# Altium schematic sheet Kasli-SOC_bank500-501.SchDoc: SOC
size 420 x 297 mm; CheckedBy: G.Kasprowicz; Author: F.Switakowski; CompanyName: WUT ISE; DrawnBy: F.Switakowski; Organization: WUT ISE; Address1: PW ISE; Address2: Nowowiejska 15/19 00-665 Warsaw; Address3: gkasprow@gmail.com; DocumentNumber: 3; Revision: 1; SheetNumber: 3; SheetTotal: 18; ModifiedBy: -; CheckedDate: -; Title2: Bank 500-501; DivGrp: WUT ISE; Designer: G.Kasprowicz; ModifiedDate: -; ProjectName: Sensor Box
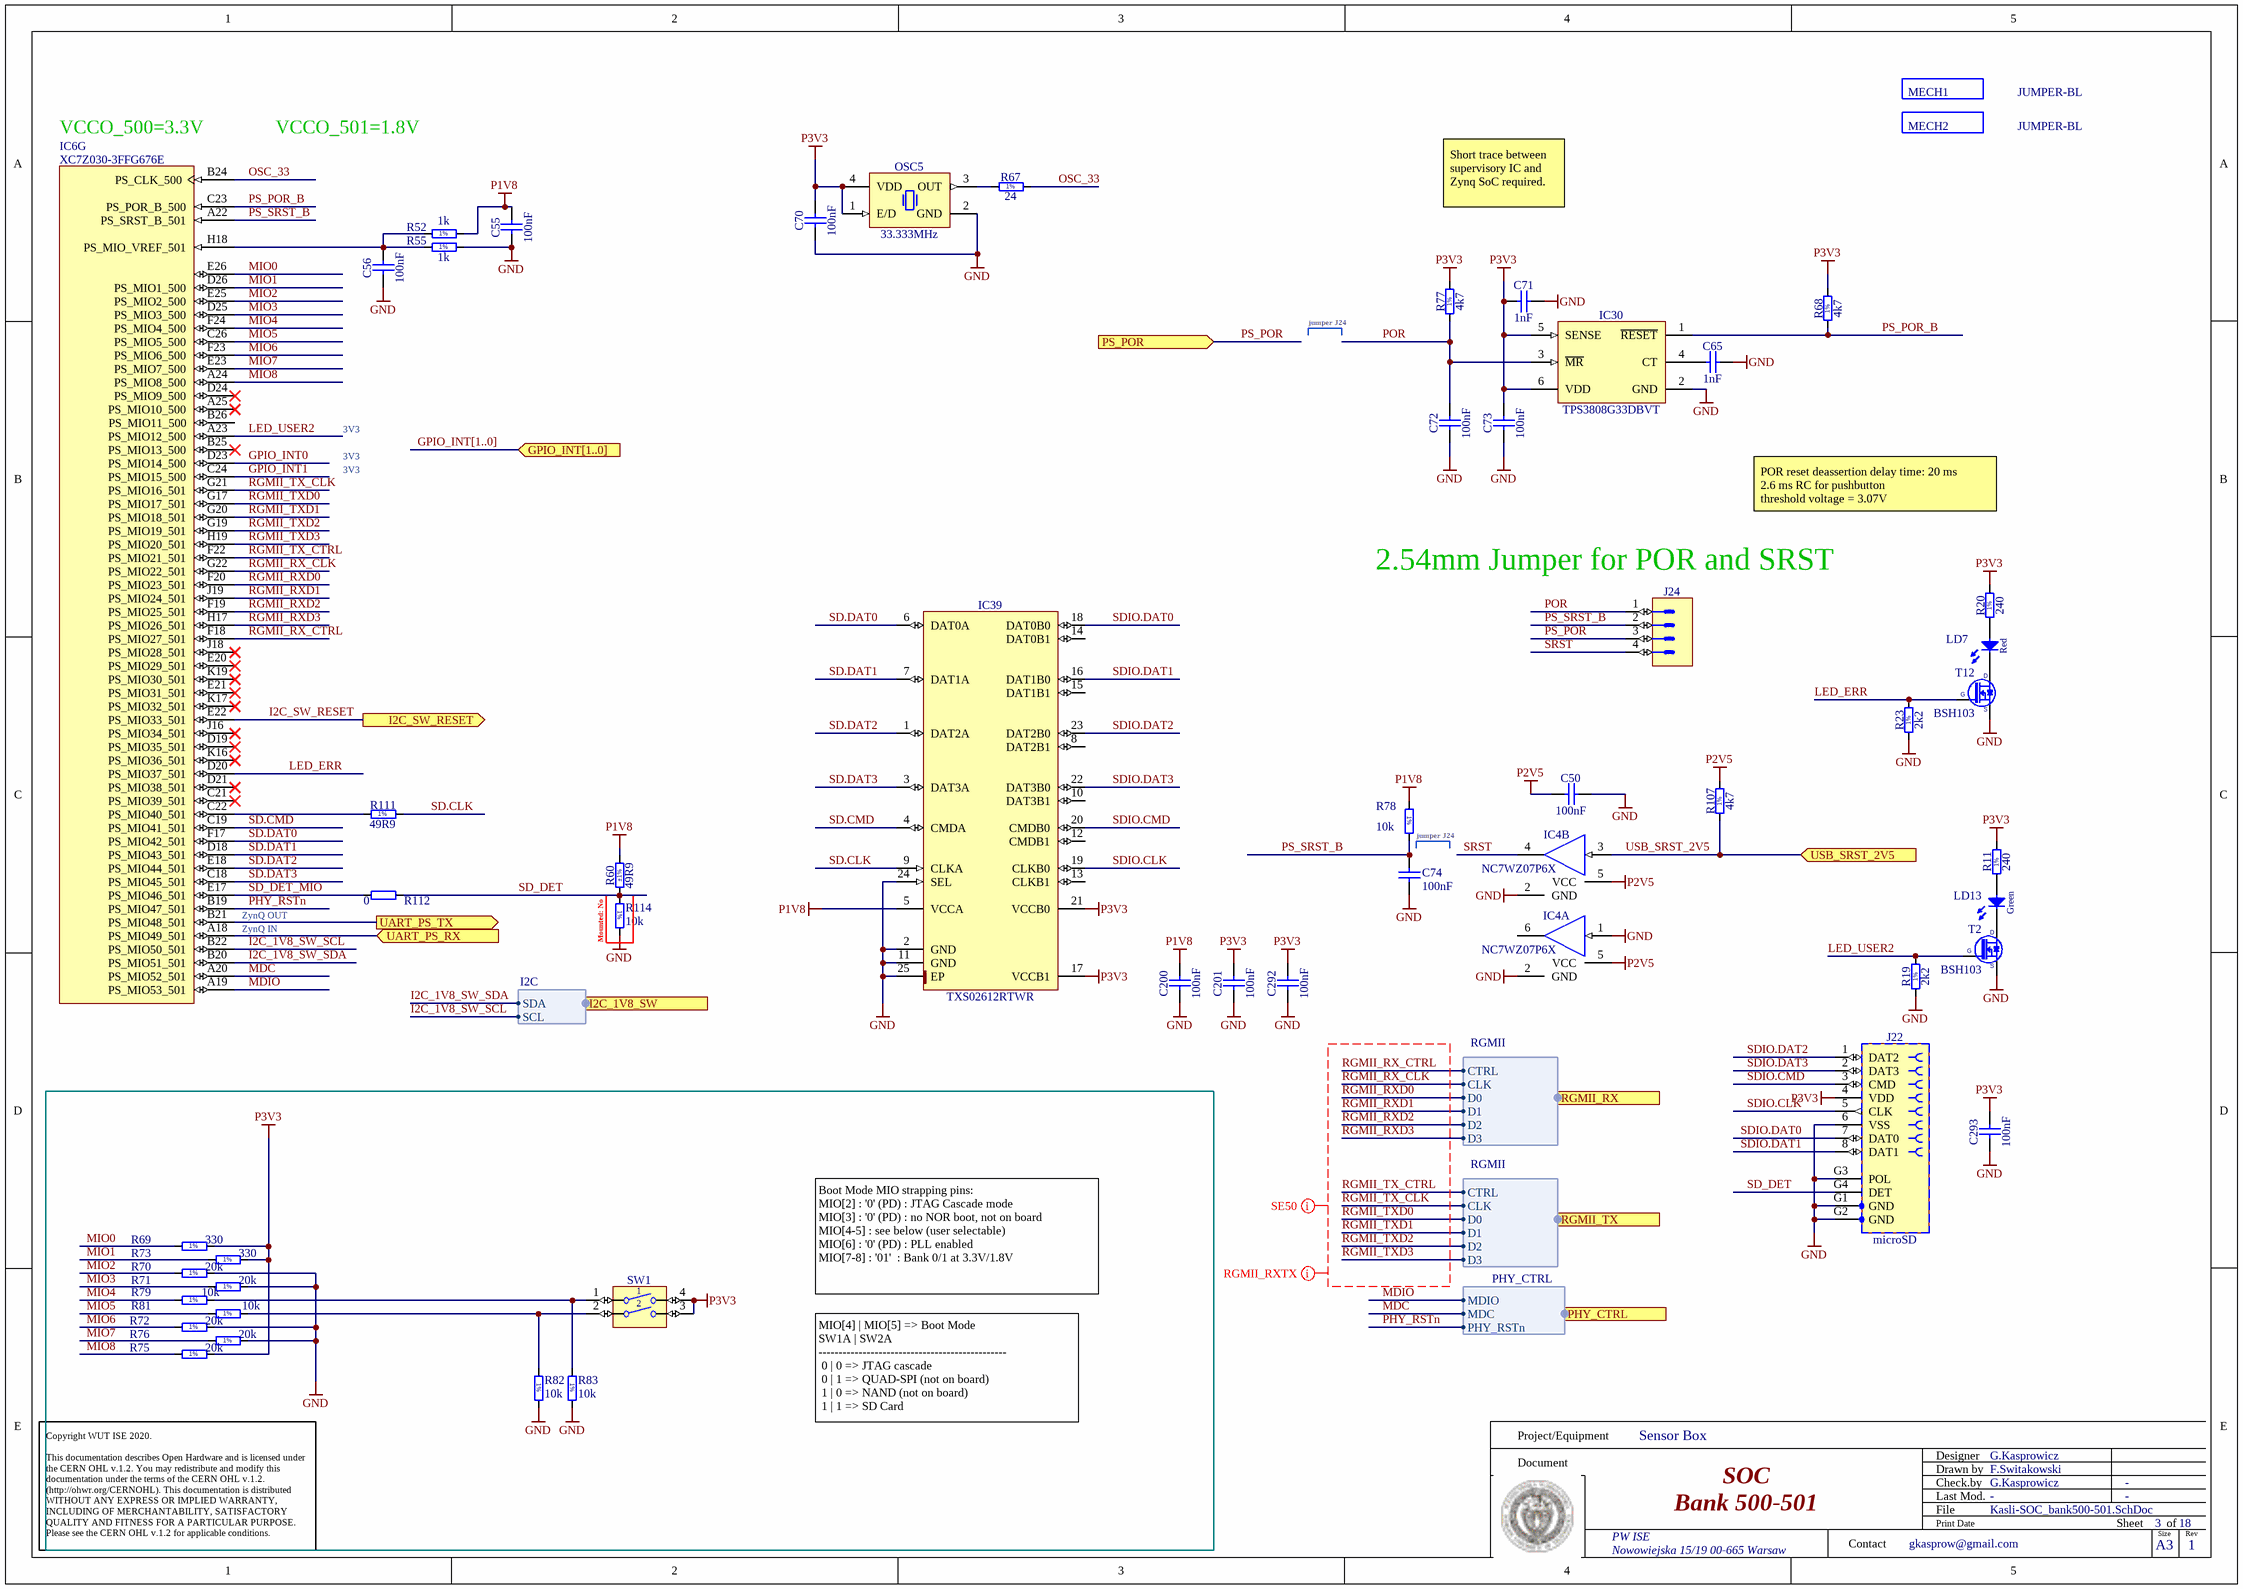
[diagram p0: Kasli-SOC_bank500-501.SchDoc]

## Parts
C50  100nF  [CAPC0603X33N]
C55  100nF  [CAPC1005X55N]
C56  100nF  [CAPC1005X55N]
C65  1nF  [CAPC1005X55N]
C70  100nF  [CAPC1005X55N]
C71  1nF  [CAPC1005X55N]
C72  100nF  [CAPC1005X55N]
C73  100nF  [CAPC1005X55N]
C74  100nF  [CAPC1005X55N]
C200  100nF  [CAPC1005X55N]
C201  100nF  [CAPC1005X55N]
C292  100nF  [CAPC1005X55N]
C293  100nF  [CAPC1005X55N]
IC4  NC7WZ07P6X  [SOT65P210X110-6N]  (parts A,B of 2)
IC6  XC7Z030-3FFG676E  [BGA676C100P26X26_2700X2700X324]  (part G of 14)
IC30  TPS3808G33DBVT  [SOT95P280X145-6N]
IC39  TXS02612RTWR  [QFN50P400X400X80-25N-S255]
J22  microSD  [MOLEX_47309-2651]
J24  Header 2  [SAMTEC_TSM-102-01-L-DV]  (value not drawn)
LD7  Red  [LED_AVAGO_HSMC-C120]
LD13  Green  [LED_AVAGO_HSME-C120]
MECH1  JUMPER-BL  (mechanical)
MECH2  JUMPER-BL  (mechanical)
OSC5  33.333MHz  [OSC_IDT_XLH7]
R11  240  [RESC1005X40N]
R19  2k2  [RESC1005X40N]
R20  240  [RESC1005X40N]
R23  2k2  [RESC1005X40N]
R52  1k  [RESC1005X40N]
R55  1k  [RESC1005X40N]
R60  49R9  Tolerance: ±1%  [RESC1608X55N]
R67  24  [RESC1005X40N]
R68  4k7  [RESC1005X40N]
R69  330  [RESC1005X40N]
R70  20k  [RESC1005X40N]
R71  20k  [RESC1005X40N]
R72  20k  [RESC1005X40N]
R73  330  [RESC1005X40N]
R75  20k  [RESC1005X40N]
R76  20k  [RESC1005X40N]
R77  4k7  [RESC1005X40N]
R78  10k  [RESC1005X40N]
R79  10k  [RESC1005X40N]
R81  10k  [RESC1005X40N]
R82  10k  [RESC1005X40N]
R83  10k  [RESC1005X40N]
R107  4k7  [RESC1005X40N]
R111  49R9  [RESC1005X40N]
R112  0  [RESC1005X40N]
R114  10k  [RESC1005X40N]
SW1  Switch  [SW_TYCO_1571983-1]  (value not drawn)
T2  BSH103  [SOT95P230X110-3N]
T12  BSH103  [SOT95P230X110-3N]

## Ports
GPIO_INT[1..0] (in), I2C_1V8_SW (harness I2C), I2C_SW_RESET (out), PHY_CTRL (harness PHY_CTRL), PS_POR (in), RGMII_RX (harness RGMII), RGMII_TX (harness RGMII), UART_PS_RX (in), UART_PS_TX (out), USB_SRST_2V5 (in)

## Harnesses
I2C: SDA, SCL
RGMII: CTRL, CLK, D0, D1, D2, D3
PHY_CTRL: MDIO, MDC, PHY_RSTn

## Nets
GND: C50.2 C55.1 C56.1 C65.2 C70.1 C71.2 C72.1 C73.1 C74.2 C200.1 C201.1 C292.1 C293.1 IC4.1(IN) IC4.2(GND) IC30.2(GND) IC39.2(GND) IC39.11(GND) IC39.24(SEL) IC39.25(EP) J22.6(VSS) J22.G1(GND) J22.G2(GND) J22.G3(POL) OSC5.2(GND) R19.1 R23.1 R55.2 R70.2 R71.2 R72.2 R76.2 R82.2 R83.2 R114.2 T2.2(S) T12.2(S)
P1V8: C55.2 C200.2 IC39.5(VCCA) R52.2 R60.2 R78.1
P2V5: C50.1 IC4.5(VCC) R107.2
P3V3: C70.2 C71.1 C73.2 C201.2 C292.2 C293.2 IC30.5(SENSE) IC30.6(VDD) IC39.17(VCCB1) IC39.21(VCCB0) J22.4(VDD) OSC5.1(E/D) OSC5.4(VDD) R11.2 R20.2 R68.2 R69.2 R73.2 R75.2 R77.2 SW1.3 SW1.4
GPIO_INT0: IC6.D23(PS_MIO14_500)
GPIO_INT1: IC6.C24(PS_MIO15_500)
I2C_1V8_SW_SCL: IC6.B22(PS_MIO50_501) ; port I2C_1V8_SW.SCL
I2C_1V8_SW_SDA: IC6.B20(PS_MIO51_501) ; port I2C_1V8_SW.SDA
I2C_SW_RESET: IC6.E22(PS_MIO33_501) ; port I2C_SW_RESET
LED_ERR: IC6.D20(PS_MIO37_501) R23.2 T12.1(G)
LED_USER2: IC6.A23(PS_MIO12_500) R19.2 T2.1(G)
MDC: IC6.A20(PS_MIO52_501) ; port PHY_CTRL.MDC
MDIO: IC6.A19(PS_MIO53_501) ; port PHY_CTRL.MDIO
MIO0: IC6.E26(PS_MIO0_500) R69.1
MIO1: IC6.D26(PS_MIO1_500) R73.1
MIO2: IC6.E25(PS_MIO2_500) R70.1
MIO3: IC6.D25(PS_MIO3_500) R71.1
MIO4: IC6.F24(PS_MIO4_500) R79.1
MIO5: IC6.C26(PS_MIO5_500) R81.1
MIO6: IC6.F23(PS_MIO6_500) R72.1
MIO7: IC6.E23(PS_MIO7_500) R76.1
MIO8: IC6.A24(PS_MIO8_500) R75.1
OSC_33: IC6.B24(PS_CLK_500) R67.2
PHY_RSTn: IC6.B19(PS_MIO47_501) ; port PHY_CTRL.PHY_RSTn
POR: C72.2 IC30.3(~{MR}) J24.1 R77.1
PS_POR: J24.3 ; port PS_POR
PS_POR_B: IC6.C23(PS_POR_B_500) IC30.1(~{RESET}) R68.1
PS_SRST_B: C74.1 IC6.A22(PS_SRST_B_501) J24.2 R78.2
RGMII_RX_CLK: IC6.G22(PS_MIO22_501) ; port RGMII_RX.CLK
RGMII_RX_CTRL: IC6.F18(PS_MIO27_501) ; port RGMII_RX.CTRL
RGMII_RXD0: IC6.F20(PS_MIO23_501) ; port RGMII_RX.D0
RGMII_RXD1: IC6.J19(PS_MIO24_501) ; port RGMII_RX.D1
RGMII_RXD2: IC6.F19(PS_MIO25_501) ; port RGMII_RX.D2
RGMII_RXD3: IC6.H17(PS_MIO26_501) ; port RGMII_RX.D3
RGMII_TX_CLK: IC6.G21(PS_MIO16_501) ; port RGMII_TX.CLK
RGMII_TX_CTRL: IC6.F22(PS_MIO21_501) ; port RGMII_TX.CTRL
RGMII_TXD0: IC6.G17(PS_MIO17_501) ; port RGMII_TX.D0
RGMII_TXD1: IC6.G20(PS_MIO18_501) ; port RGMII_TX.D1
RGMII_TXD2: IC6.G19(PS_MIO19_501) ; port RGMII_TX.D2
RGMII_TXD3: IC6.H19(PS_MIO20_501) ; port RGMII_TX.D3
SD.CLK: IC39.9(CLKA) R111.2
SD.CMD: IC6.C19(PS_MIO41_501) IC39.4(CMDA)
SD.DAT0: IC6.F17(PS_MIO42_501) IC39.6(DAT0A)
SD.DAT1: IC6.D18(PS_MIO43_501) IC39.7(DAT1A)
SD.DAT2: IC6.E18(PS_MIO44_501) IC39.1(DAT2A)
SD.DAT3: IC6.C18(PS_MIO45_501) IC39.3(DAT3A)
SD_DET: J22.G4(DET) R60.1 R112.1 R114.1
SD_DET_MIO: IC6.E17(PS_MIO46_501) R112.2
SDIO.CLK: IC39.19(CLKB0) J22.5(CLK)
SDIO.CMD: IC39.20(CMDB0) J22.3(CMD)
SDIO.DAT0: IC39.18(DAT0B0) J22.7(DAT0)
SDIO.DAT1: IC39.16(DAT1B0) J22.8(DAT1)
SDIO.DAT2: IC39.23(DAT2B0) J22.1(DAT2)
SDIO.DAT3: IC39.22(DAT3B0) J22.2(DAT3)
SRST: IC4.4(OUT) J24.4
UART_PS_RX: IC6.A18(PS_MIO49_501) ; port UART_PS_RX
UART_PS_TX: IC6.B21(PS_MIO48_501) ; port UART_PS_TX
USB_SRST_2V5: IC4.3(IN) R107.1 ; port USB_SRST_2V5
NetC56_2: C56.2 IC6.H18(PS_MIO_VREF_501) R52.1 R55.1
NetC65_1: C65.1 IC30.4(CT)
NetIC6_C22: IC6.C22(PS_MIO40_501) R111.1
NetLD7_1: LD7.1(C) T12.3(D)
NetLD7_2: LD7.2(A) R20.1
NetLD13_1: LD13.1(C) T2.3(D)
NetLD13_2: LD13.2(A) R11.1
NetOSC5_3: OSC5.3(OUT) R67.1
NetR79_2: R79.2 R83.1 SW1.1
NetR81_2: R81.2 R82.1 SW1.2

Not connected (* = marked no-connect by the designer): IC4 6(OUT); IC6 A25(PS_MIO10_500)* B25(PS_MIO13_500)* B26(PS_MIO11_500) C21(PS_MIO39_501)* D19(PS_MIO35_501)* D21(PS_MIO38_501)* D24(PS_MIO9_500)* E20(PS_MIO29_501)* E21(PS_MIO31_501)* J16(PS_MIO34_501)* J18(PS_MIO28_501)* K16(PS_MIO36_501)* K17(PS_MIO32_501)* K19(PS_MIO30_501)*; IC39 8(DAT2B1) 10(DAT3B1) 12(CMDB1) 13(CLKB1) 14(DAT0B1) 15(DAT1B1)

## Buses and harness runs
bus GPIO_INT[1..0] = port GPIO_INT[1..0]

## Layout directives
net class RGMII_RXTX: RGMII_RX_CLK, RGMII_RX_CTRL, RGMII_RXD0, RGMII_RXD1, RGMII_RXD2, RGMII_RXD3, RGMII_TX_CLK, RGMII_TX_CTRL, RGMII_TXD0, RGMII_TXD1, RGMII_TXD2, RGMII_TXD3
net class SE50: RGMII_RX_CLK, RGMII_RX_CTRL, RGMII_RXD0, RGMII_RXD1, RGMII_RXD2, RGMII_RXD3, RGMII_TX_CLK, RGMII_TX_CTRL, RGMII_TXD0, RGMII_TXD1, RGMII_TXD2, RGMII_TXD3

## Notes on the sheet
- (near IC6) VCCO_500=3.3V
- VCCO_501=1.8V
- Short trace between supervisory IC and Zynq SoC required.
- jumper J24
- 3V3
- POR reset deassertion delay time: 20 ms
  2.6 ms RC for pushbutton
  threshold voltage = 3.07V
- (near J24) 2.54mm Jumper for POR and SRST
- (near R78) jumper J24
- (near IC6) ZynQ OUT
- (near IC6) ZynQ IN
- Mounted: No
- Boot Mode MIO strapping pins:
  MIO[2]	: '0' (PD)	: JTAG Cascade mode
  MIO[3]	: '0' (PD)	: no NOR boot, not on board
  MIO[4-5]	: see below (user selectable)
  MIO[6]	: '0' (PD)	: PLL enabled
  MIO[7-8]	: '01' 	: Bank 0/1 at 3.3V/1.8V
- MIO[4]	| MIO[5]	=> Boot Mode
  SW1A	| SW2A
  -----------------------------------------------
  0	| 0	=> JTAG cascade
  0	| 1	=> QUAD-SPI (not on board)
  1	| 0	=> NAND (not on board)
  1	| 1	=> SD Card
- Project/Equipment
- Document
- Designer
- Drawn by
- Check.by
- Copyright WUT ISE 2020.
  This documentation describes Open Hardware and is licensed under the CERN OHL v.1.2. You may redistribute and modify this documentation under the terms of the CERN OHL v.1.2. (http://ohwr.org/CERNOHL). This documentation is distributed WITHOUT ANY EXPRESS OR IMPLIED WARRANTY, INCLUDING OF MERCHANTABILITY, SATISFACTORY QUALITY AND FITNESS FOR A PARTICULAR PURPOSE. Please see the CERN OHL v.1.2 for applicable conditions.
- Contact
- File
- Last Mod.
- Print Date
- Sheet
- Size
- A3
- of
- Rev
- (in symbol R0402_1K_1%_0.0625W_100PPM) 1%
- (in symbol R0402_2K2_1%_0.0625W_100PPM) 1%
- (in symbol R0402_4K7_1%_0.0625W_100PPM) 1%
- (in symbol R0402_10K_1%_0.0625W_100PPM) 1%
- (in symbol R0402_20K_1%_0.0625W_100PPM) 1%
- (in symbol R0402_24R_1%_0.0625W_100PPM) 1%
- (in symbol R0402_49R9_1%_0.0625W_100PPM) 1%
- (in symbol R0402_240R_1%_0.0625W_100PPM) 1%
- (in symbol R0402_330R_1%_0.0625W_100PPM) 1%

## Library data of the parts
C50 = CC0201_100NF_6.3V_10%_X5R: Non-polarised capacitor; Part Description: SMD Multilayer Chip Ceramic Capacitor; Manufacturer: GENERIC; Manufacturer1 Part Number: 02016D104KAT2A; Voltage: 6.3V; TC: X5R; Tolerance: ±10%; Part Number: CC0201_100NF_6.3V_10%_X5R; Component Kind: Standard; Component Type: Standard; Pin Count: 2; Value: 100nF; Status: Not Recommended; Manufacturer Part Number: CC0201_100NF_6.3V_10%_X5R; Case: 0201; Mounted: Yes; Socket: No; SMD: Yes; Sense: No; Manufacturer1 Example: AVX; Manufacturer1 ComponentHeight: 0.33mm; HelpURL: \\cern.ch\dfs\Applications\Altium\Datasheets\CC0201_X5R_AVX.pdf; Author: CERN DEM JLC; CreateDate: 03.12.2007; LatestRevisionDate: 03.12.2007
C55 C56 C70 C72 C73 C200 C201 C292 C293 = CC0402_100NF_16V_10%_X7R: Non-polarised capacitor; Part Description: SMD Multilayer Chip Ceramic Capacitor; Manufacturer: GENERIC; Manufacturer1 Part Number: GRM155R71C104KA88D; Voltage: 16V; TC: X7R; Tolerance: ±10%; Part Number: CC0402_100NF_16V_10%_X7R; Component Kind: Standard; Component Type: Standard; Pin Count: 2; Value: 100nF; Status: Not Recommended; Manufacturer Part Number: CC0402_100NF_16V_10%_X7R; Case: 0402; Mounted: Yes; Socket: No; SMD: Yes; Sense: No; Manufacturer1 Example: MURATA; Manufacturer1 ComponentHeight: 0.55mm; HelpURL: \\cern.ch\dfs\Applications\Altium\Datasheets\CC0402_X7R_MURATA_GRM.pdf; Author: CERN DEM JLC; CreateDate: 05/12/2013; LatestRevisionDate: 03/12/2007
C65 C71 = CC0402_1NF_50V_10%_X7R: Non-polarised capacitor; Part Description: SMD Multilayer Chip Ceramic Capacitor; Manufacturer: GENERIC; Manufacturer1 Part Number: 223858715623; Voltage: 50V; TC: X7R; Tolerance: ±10%; Part Number: CC0402_1NF_50V_10%_X7R; Component Kind: Standard; Component Type: Standard; Pin Count: 2; Value: 1nF; Status: Not Recommended; Manufacturer Part Number: CC0402_1NF_50V_10%_X7R; Case: 0402; Mounted: Yes; Socket: No; SMD: Yes; Sense: No; Manufacturer1 Example: PHYCOMP; Manufacturer1 ComponentHeight: 0.55mm; HelpURL: \\cern.ch\dfs\Applications\Altium\Datasheets\CC0402_X7R_PHYCOMP.pdf; Author: CERN DEM JLC
  C65: CreateDate: 03.12.2007; LatestRevisionDate: 03.12.2007
  C71: CreateDate: 03/12/2007; LatestRevisionDate: 03/12/2007
C74 = CC0402_100NF_16V_10%_X7R: Non-polarised capacitor; Part Description: SMD Multilayer Chip Ceramic Capacitor; Manufacturer: GENERIC; Manufacturer1 Part Number: GRM155R71C104KA88D; Voltage: 16V; TC: X7R; Tolerance: ±10%; Table: Capacitors SMD; Part Number: CC0402_100NF_16V_10%_X7R; Component Kind: Standard; Component Type: Standard; Pin Count: 2; Value: 100nF; Status: Not Recommended; Manufacturer Part Number: CC0402_100NF_16V_10%_X7R; Case: 0402; Mounted: Yes; Socket: No; SMD: Yes; Manufacturer1 Example: MURATA; Manufacturer1 ComponentHeight: 0.55mm; HelpURL: \\cern.ch\dfs\Applications\Altium\Datasheets\CC0402_X7R_MURATA_GRM.pdf; Author: CERN DEM JLC; CreateDate: 2013-12-05; LatestRevisionDate: 2007-12-03
IC4 = NC7WZ07P6X: TinyLogic® UHS Dual Buffer (Open Drain Outputs); Manufacturer: FAIRCHILD SEMICONDUCTOR; PressFit: No; Bonding: No; Part Number: NC7WZ07P6X; Component Kind: Standard; Component Type: Standard; Device: NC7WZ07P6X; PackageDescription: SOT363, 0.65mm pitch; 6 pin, 1.40mm W X 2.15mm L, IPC Medium Density; Part Description: TinyLogic® UHS Dual Buffer (Open Drain Outputs); Manufacturer Part Number: NC7WZ07P6X; Pin Count: 6; Case: SOT363; Mounted: Yes; Socket: No; SMD: Yes; Sense: No; ComponentHeight: 1.1mm; Author: CERN DEM JLC; HelpURL: \\cern.ch\dfs\Applications\Altium\Datasheets\NC7WZ07P6X.pdf; CreateDate: 22/10/2008; LatestRevisionDate: 22/03/2012
IC6 = XC7Z030-2FFG676I: 733 MHz Zynq™-7000 AP SoC, 130 PS I/O, 254 FPGA I/O, 676-Ball BGA, Speed Grade 2, Industrial Grade, Pb-Free; Part Description: Zynq™-7000 All Programmable SoC, Dual-core ARM® Cortex™-A9 CPU, 676-Ball BGA, Speed Grade 2, Industrial Grade, Pb-Free; Manufacturer: XILINX; PressFit: No; Bonding: No; Part Number: XC7Z030-3FFG676E; Component Kind: Standard; Component Type: Standard; Device: XC7Z030-2FFG676I; PackageDescription: BGA, 1.00mm Pitch, Square; 676 Pin, 26 Columns X 26 Rows, 27.00mm X 27.00mm X 2.60mm H; Manufacturer Part Number: XC7Z030-3FFG676E; Pin Count: 676; Case: BGA676; Mounted: Yes; Socket: No; SMD: Yes; Sense: No; ComponentHeight: 3.24mm; HelpURL: \\cern.ch\dfs\Applications\Altium\Datasheets\XC7Z030-2FFG676I.pdf; ComponentLink1URL: \\cern.ch\dfs\Applications\Altium\Datasheets\XC7Z030-2FFG676I_Package.pdf; ComponentLink1Description: Package; ComponentLink2URL: \\cern.ch\dfs\Applications\Altium\Datasheets\XC7Z030-2FFG676I_Pinout.txt; ComponentLink2Description: Pinout; Author: CERN DEM JLC; CreateDate: 29/04/2014; LatestRevisionDate: 29/04/2014
IC30 = TPS3808G33DBVT: Low Quiescent Current, Programmable-Delay Supervisory Circuit; Part Description: 3.3V, Low Quiescent Current, Programmable-Delay Supervisory Circuit; Manufacturer: TEXAS INSTRUMENTS; PressFit: No; Bonding: No; Part Number: TPS3808G33DBVT; Component Kind: Standard; Component Type: Standard; Device: TPS3808G33DBVT; PackageDescription: SOT23, 6-Leads, Body 1.6x3.0mm, Pitch 0.95mm, IPC Medium Density; Manufacturer Part Number: TPS3808G33DBVT; Pin Count: 6; Case: SOT23-6; Mounted: Yes; Socket: No; SMD: Yes; Sense: No; ComponentHeight: 1.45mm; Author: CERN DEM JLC; HelpURL: \\cern.ch\dfs\Applications\Altium\Datasheets\TPS3808G33DBVT.pdf; CreateDate: 05/11/2013; LatestRevisionDate: 05/11/2013
IC39 = TXS02612RTWR: SDIO Port Expander With Voltage-Level Translation; Manufacturer: TEXAS INSTRUMENTS; PressFit: No; Bonding: No; Part Number: TXS02612RTWR; Component Kind: Standard; Component Type: Standard; Device: TXS02612RTWR; PackageDescription: QFN, 0.50mm Pitch, Square; 24 Pin, 4.00mm L X 4.00mm W X 0.80mm H body (w/Thermal Tab 2.55 X 2.55mm), IPC Medium Density; Part Description: SDIO Port Expander With Voltage-Level Translation; Manufacturer Part Number: TXS02612RTWR; Pin Count: 25; Case: QFN24; Mounted: Yes; Socket: No; SMD: Yes; Sense: No; ComponentHeight: 0.8mm; Author: CERN DEM JLC; HelpURL: \\cern.ch\dfs\Applications\Altium\Datasheets\TXS02612RTWR.pdf; CreateDate: 19.11.2014; LatestRevisionDate: 19.11.2014
J22 = MOLEX_47309-2651: MicroSD Card Header with Detect Switch; Part Description: 1.10mm Pitch microSD Card Header with Detect Switch; Manufacturer: MOLEX; PressFit: No; Part Number: MOLEX_47309-2651; Component Kind: Standard; Component Type: Standard; Pin Count: 12; Family: microSD; Mounted: Yes; Socket: No; SMD: Yes; Sense: No; Status: None; Manufacturer Part Number: 47309-2651; ComponentHeight: 2.65mm; HelpURL: \\cern.ch\dfs\Applications\Altium\Datasheets\MOLEX_47309-2651.pdf; Author: CERN DEM JMW; CreateDate: 29.06.2017; LatestRevisionDate: 29.06.2017
J24 = SAMTEC_TSM-102-01-L-DV: Connector 4 Male; Part Description: 2 Contacts, Pitch 2.54mm, Dual Row Surface Mount Straight Header (Post Lead 5.84mm); Manufacturer: SAMTEC; PressFit: No; Part Number: SAMTEC_TSM-102-01-L-DV; Component Kind: Standard; Component Type: Standard; Pin Count: 4; Family: Header 2; Mounted: Yes; Socket: No; SMD: Yes; Sense: No; Status: None; Manufacturer Part Number: TSM-102-01-L-DV; ComponentHeight: 9.65mm; HelpURL: \\cern.ch\dfs\Applications\Altium\Datasheets\SAMTEC_TSM-102-01-L-DV.pdf; Author: CERN DEM MR; CreateDate: 28.11.2017; LatestRevisionDate: 28.11.2017
LD7 = LED_AVAGO_HSMC-C120: LED Red 1C 2A; Part Description: High Performance Right Angle Chip Red LED; Manufacturer: AVAGO TECHNOLOGIES; PressFit: No; Bonding: No; Manufacturer Part Number: HSMC-C120; ComponentHeight: 0.7mm; HelpURL: \\cern.ch\dfs\Applications\Altium\Datasheets\LED_AVAGO_HSMC-C120.pdf; Part Number: LED_AVAGO_HSMC-C120; Component Kind: Standard; Component Type: Standard; Color: Red; PackageDescription: Red Chip LED, 2-Leads, Body 1.7x1.1mm, Side Emitting Package; Pin Count: 2; Mounted: Yes; Socket: No; SMD: Yes; Sense: No; Author: CERN DEM JMW; CreateDate: 2009-07-22; LatestRevisionDate: 2012-06-20; ComponentLink1URL: \\cern.ch\dfs\Applications\Altium\Datasheets\LED_AVAGO_HSMC-C120_DESIGN-GUIDE.pdf; ComponentLink1Description: Design Guide
LD13 = LED_AVAGO_HSME-C120: LED Green 1C 2A; Part Description: High Performance Right Angle Chip Green LED; Manufacturer: AVAGO TECHNOLOGIES; PressFit: No; Bonding: No; Manufacturer Part Number: HSME-C120; ComponentHeight: 0.7mm; HelpURL: \\cern.ch\dfs\Applications\Altium\Datasheets\LED_AVAGO_HSME-C120.pdf; Part Number: LED_AVAGO_HSME-C120; Component Kind: Standard; Component Type: Standard; Color: Green; PackageDescription: Green Chip LED, 2-Leads, Body 1.7x1.1mm, Side Emitting Package; Pin Count: 2; Mounted: Yes; Socket: No; SMD: Yes; Sense: No; Author: CERN DEM JMW; CreateDate: 22.07.2009; LatestRevisionDate: 20.06.2012; ComponentLink1URL: \\cern.ch\dfs\Applications\Altium\Datasheets\LED_AVAGO_HSME-C110_DESIGN-GUIDE.pdf; ComponentLink1Description: Design Guide
MECH1 MECH2 = Generic_mechanical: Jumper; Manufacturer: NINGI; PressFit: No; Value: 2.54mm; Part Number: JUMPER-BL; Component Type: Standard; Footprint: generic_MECH; Pin Count: 0; PackageDescription: generic; Mounted: Yes; Socket: No; SMD: No; Sense: No; Status: None; Part Description: Jumper; Manufacturer Part Number: JUMPER-BL; ComponentHeight: generic; Author: GK; CreateDate: 28.10.2019; LatestRevisionDate: 28.10.2019
OSC5 = OSC_33.333MHZ_IDT_XLH736033.333000I: Oscillator 4 pins 1=E/D 2=GND 3=OUT 4=VDD; Part Description: 3.3V, ±25ppm, -40 to +85°C, HCMOS Crystal Oscillator with Tri-State Output, XLH Series; Manufacturer: IDT; PressFit: No; Bonding: No; Part Number: OSC_33.333MHZ_IDT_XLH736033.333000I; Component Kind: Standard; Component Type: Standard; PackageDescription: SMD Oscillator, Side Convave, 6 Pins, 5.00x7.00mm IDT XLH Series; Value: 33.333MHz; Manufacturer Part Number: XLH736033.333000I; Pin Count: 4; Mounted: Yes; Socket: No; SMD: Yes; Sense: No; ComponentHeight: 1.45mm; HelpURL: \\cern.ch\dfs\Applications\Altium\Datasheets\OSC_IDT_XLH.pdf; Author: CERN DEM JLC; CreateDate: 14/08/2017; LatestRevisionDate: 14/08/2017
R11 R20 = R0402_240R_1%_0.0625W_100PPM: Resistor - 1%; Part Description: General Purpose Thick Film Chip Resistor; Manufacturer: GENERIC; Manufacturer1 Part Number: 232270672401L; TC: ±100ppm/°C; PressFit: No; Part Number: R0402_240R_1%_0.0625W_100PPM; Component Kind: Standard; Component Type: Standard; Pin Count: 2; Value: 240; Status: Not Recommended; Power: 0.0625W; Tolerance: ±1%; Manufacturer Part Number: R0402_240R_1%_0.0625W_100PPM; Case: 0402; Mounted: Yes; Sense: No; Socket: No; SMD: Yes; Manufacturer1 Example: YAGEO PHYCOMP; Manufacturer1 ComponentHeight: 0.4mm; HelpURL: \\cern.ch\dfs\Applications\Altium\Datasheets\R0402_Phycomp_RC0402.pdf; Author: CERN DEM JLC; CreateDate: 03.12.2007; LatestRevisionDate: 17.10.2012
R19 R23 = R0402_2K2_1%_0.0625W_100PPM: Resistor - 1%; Part Description: General Purpose Thick Film Chip Resistor; Manufacturer: GENERIC; Manufacturer1 Part Number: 232270672202L; TC: ±100ppm/°C; PressFit: No; Part Number: R0402_2K2_1%_0.0625W_100PPM; Component Kind: Standard; Component Type: Standard; Pin Count: 2; Value: 2k2; Status: Not Recommended; Power: 0.0625W; Tolerance: ±1%; Manufacturer Part Number: R0402_2K2_1%_0.0625W_100PPM; Case: 0402; Mounted: Yes; Sense: No; Socket: No; SMD: Yes; Manufacturer1 Example: YAGEO PHYCOMP; Manufacturer1 ComponentHeight: 0.4mm; HelpURL: \\cern.ch\dfs\Applications\Altium\Datasheets\R0402_Phycomp_RC0402.pdf; Author: CERN DEM JLC; CreateDate: 03.12.2007; LatestRevisionDate: 17.10.2012; ClassName: Artix
R52 R55 = R0402_1K_1%_0.0625W_100PPM: Resistor - 1%; Part Description: General Purpose Thick Film Chip Resistor; Manufacturer: GENERIC; Manufacturer1 Part Number: 232270671002L; TC: ±100ppm/°C; PressFit: No; Part Number: R0402_1K_1%_0.0625W_100PPM; Component Kind: Standard; Component Type: Standard; Pin Count: 2; Value: 1k; Status: Not Recommended; Power: 0.0625W; Tolerance: ±1%; Manufacturer Part Number: R0402_1K_1%_0.0625W_100PPM; Case: 0402; Mounted: Yes; Sense: No; Socket: No; SMD: Yes; Manufacturer1 Example: YAGEO PHYCOMP; Manufacturer1 ComponentHeight: 0.4mm; HelpURL: \\cern.ch\dfs\Applications\Altium\Datasheets\R0402_Phycomp_RC0402.pdf; Author: CERN DEM JLC; CreateDate: 03.12.2007; LatestRevisionDate: 17.10.2012
R60 = R0603_49K9_1%_0.1W_100PPM: Resistor - 1%; Part Description: General Purpose Thick Film Chip Resistor; Manufacturer: GENERIC; Manufacturer Part Number: R0603_49R9_1%_0.1W_100PPM; Manufacturer1 Part Number: CRCW060349R9FKEA; Power: 0.1W; TC: ±100ppm/°C; PressFit: No; Part Number: R0603_49K9_1%_0.1W_100PPM; Component Kind: Standard; Component Type: Standard; Pin Count: 2; Value: 49R9; Status: Preferred; Case: 0603; Mounted: Yes; Sense: No; Socket: No; SMD: Yes; Manufacturer1 Example: VISHAY; Manufacturer1 ComponentHeight: 0.55mm; HelpURL: \\cern.ch\dfs\Applications\Altium\Datasheets\R0603_VISHAY_CRCW e3.pdf; Author: CERN DEM JLC; CreateDate: 16.11.2017; LatestRevisionDate: 16.11.2017
R67 = R0402_24R_1%_0.0625W_100PPM: Resistor - 1%; Part Description: General Purpose Thick Film Chip Resistor; Manufacturer: GENERIC; Manufacturer1 Part Number: 232270672409L; TC: ±100ppm/°C; PressFit: No; Part Number: R0402_24R_1%_0.0625W_100PPM; Component Kind: Standard; Component Type: Standard; Pin Count: 2; Value: 24; Status: Not Recommended; Power: 0.0625W; Tolerance: ±1%; Manufacturer Part Number: R0402_24R_1%_0.0625W_100PPM; Case: 0402; Mounted: Yes; Sense: No; Socket: No; SMD: Yes; Manufacturer1 Example: YAGEO PHYCOMP; Manufacturer1 ComponentHeight: 0.4mm; HelpURL: \\cern.ch\dfs\Applications\Altium\Datasheets\R0402_Phycomp_RC0402.pdf; Author: CERN DEM JLC; CreateDate: 03.12.2007; LatestRevisionDate: 17.10.2012
R68 R77 R107 = R0402_4K7_1%_0.0625W_100PPM: Resistor - 1%; Part Description: General Purpose Thick Film Chip Resistor; Manufacturer: GENERIC; Manufacturer1 Part Number: 232270674702L; TC: ±100ppm/°C; PressFit: No; Part Number: R0402_4K7_1%_0.0625W_100PPM; Component Kind: Standard; Component Type: Standard; Pin Count: 2; Value: 4k7; Status: Not Recommended; Power: 0.0625W; Tolerance: ±1%; Manufacturer Part Number: R0402_4K7_1%_0.0625W_100PPM; Case: 0402; Mounted: Yes; Sense: No; Socket: No; SMD: Yes; Manufacturer1 Example: YAGEO PHYCOMP; Manufacturer1 ComponentHeight: 0.4mm; HelpURL: \\cern.ch\dfs\Applications\Altium\Datasheets\R0402_Phycomp_RC0402.pdf; Author: CERN DEM JLC; CreateDate: 03.12.2007; LatestRevisionDate: 17.10.2012
R69 R73 = R0402_330R_1%_0.0625W_100PPM: Resistor - 1%; Part Description: General Purpose Thick Film Chip Resistor; Manufacturer: GENERIC; Manufacturer1 Part Number: 232270673301L; TC: ±100ppm/°C; PressFit: No; Part Number: R0402_330R_1%_0.0625W_100PPM; Component Kind: Standard; Component Type: Standard; Pin Count: 2; Value: 330; Status: Not Recommended; Power: 0.0625W; Tolerance: ±1%; Manufacturer Part Number: R0402_330R_1%_0.0625W_100PPM; Case: 0402; Mounted: Yes; Sense: No; Socket: No; SMD: Yes; Manufacturer1 Example: YAGEO PHYCOMP; Manufacturer1 ComponentHeight: 0.4mm; HelpURL: \\cern.ch\dfs\Applications\Altium\Datasheets\R0402_Phycomp_RC0402.pdf; Author: CERN DEM JLC; CreateDate: 03.12.2007; LatestRevisionDate: 17.10.2012
R70-R72 R75 R76 = R0402_20K_1%_0.0625W_100PPM: Resistor - 1%; Part Description: General Purpose Thick Film Chip Resistor; Manufacturer: GENERIC; Manufacturer1 Part Number: 232270672003L; TC: ±100ppm/°C; PressFit: No; Part Number: R0402_20K_1%_0.0625W_100PPM; Component Kind: Standard; Component Type: Standard; Pin Count: 2; Value: 20k; Status: Not Recommended; Power: 0.0625W; Tolerance: ±1%; Manufacturer Part Number: R0402_20K_1%_0.0625W_100PPM; Case: 0402; Mounted: Yes; Sense: No; Socket: No; SMD: Yes; Manufacturer1 Example: YAGEO PHYCOMP; Manufacturer1 ComponentHeight: 0.4mm; HelpURL: \\cern.ch\dfs\Applications\Altium\Datasheets\R0402_Phycomp_RC0402.pdf; Author: CERN DEM JLC; CreateDate: 03.12.2007; LatestRevisionDate: 17.10.2012
R78 R79 R81-R83 R114 = R0402_10K_1%_0.0625W_100PPM: Resistor - 1%; Part Description: General Purpose Thick Film Chip Resistor; Manufacturer: GENERIC; Manufacturer1 Part Number: 232270671003L; TC: ±100ppm/°C; Table: Resistors SMD; Part Number: R0402_10K_1%_0.0625W_100PPM; Component Kind: Standard; Component Type: Standard; Pin Count: 2; Value: 10k; Status: Not recommended; Power: 0.0625W; Tolerance: ±1%; Manufacturer Part Number: R0402_10K_1%_0.0625W_100PPM; Case: 0402; Mounted: Yes; Socket: No; SMD: Yes; Manufacturer1 Example: YAGEO PHYCOMP; Manufacturer1 ComponentHeight: 0.4mm; HelpURL: \\cern.ch\dfs\Applications\Altium\Datasheets\R0402_Phycomp_RC0402.pdf; Author: CERN DEM JLC; CreateDate: 2007-12-03; LatestRevisionDate: 2012-10-17
R111 = R0402_49R9_1%_0.0625W_100PPM: Resistor - 1%; Part Description: General Purpose Thick Film Chip Resistor; Manufacturer: GENERIC; Manufacturer1 Part Number: 232270674999L or RC0402FR-0749R9L; TC: ±100ppm/°C; Part Number: R0402_49R9_1%_0.0625W_100PPM; Component Kind: Standard; Component Type: Standard; Pin Count: 2; Value: 49R9; Status: Not recommended; Power: 0.0625W; Tolerance: ±1%; Manufacturer Part Number: R0402_49R9_1%_0.0625W_100PPM; Case: 0402; Mounted: Yes; Sense: No; Socket: No; SMD: Yes; Manufacturer1 Example: YAGEO PHYCOMP; Manufacturer1 ComponentHeight: 0.4mm; HelpURL: \\cern.ch\dfs\Applications\Altium\Datasheets\R0402_Phycomp_RC0402.pdf; Author: CERN DEM JLC; CreateDate: 24.10.2012; LatestRevisionDate: 24.10.2012
R112 = R0402_0R_JUMPER: Resistor; Part Description: 1A (0.05R Max DC Resistance) Zero Ohm Jumper; Manufacturer: GENERIC; Manufacturer1 Part Number: 232270591001L; Table: Resistors SMD; Part Number: R0402_0R_JUMPER; Component Kind: Standard; Component Type: Standard; Pin Count: 2; Value: 0; Status: Not recommended; Manufacturer Part Number: R0402_0R_JUMPER; Case: 0402; Mounted: Yes; Socket: No; SMD: Yes; Manufacturer1 Example: YAGEO PHYCOMP; Manufacturer1 ComponentHeight: 0.4mm; HelpURL: \\cern.ch\dfs\Applications\Altium\Datasheets\R0402_Phycomp_RC0402.pdf; Author: CERN DEM JLC; CreateDate: 2007-12-03; LatestRevisionDate: 2012-10-17
SW1 = SW_TYCO_1571983-1: 2 Ways SPST DIP Switch; Part Description: 2 Way SPST SMD DIP Switch, Latched, Contact Rating 0.025A 24VDC; Manufacturer: TYCO; Manufacturer Part Number: 1571983-1 or GDH02S04; PressFit: No; Part Number: SW_TYCO_1571983-1; Component Kind: Standard; Component Type: Standard; Pin Count: 4; PackageDescription: Pitch 1.27mm,  Body3.66x6.2mm, 2 Ways SPST Surface-Mount DIP Switch, TYCO GDH Series; Family: Switch; Mounted: Yes; Socket: No; SMD: Yes; Sense: No; Status: None; ComponentHeight: 2.31mm; HelpURL: \\cern.ch\dfs\Applications\Altium\Datasheets\SW_TYCO_1571983-1.pdf; Author: CERN DEM JLC; CreateDate: 08.01.2009; LatestRevisionDate: 08.01.2009
T2 T12 = BSH103: N-CHANNEL MOSFET WITH DIODE; Part Description: 30V 850mA N-Channel Enhancement Mode Field-Effect Transistor; Manufacturer: NEXPERIA; PressFit: No; Bonding: No; Part Number: BSH103; Component Kind: Standard; Component Type: Standard; Device: BSH103; PackageDescription: SOT23, 3 pin, Pitch 0.95mm - 1.3mm W X 2.9mm L X 1.1mm H, IPC Medium Density; Manufacturer Part Number: BSH103; Pin Count: 3; Case: SOT23-3; Mounted: Yes; Socket: No; SMD: Yes; Sense: No; ComponentHeight: 1.1mm; HelpURL: \\cern.ch\dfs\Applications\Altium\Datasheets\BSH103.pdf; Author: CERN DEM JLC; CreateDate: 16.03.2010; LatestRevisionDate: 20.06.2017; ClassName: Artix